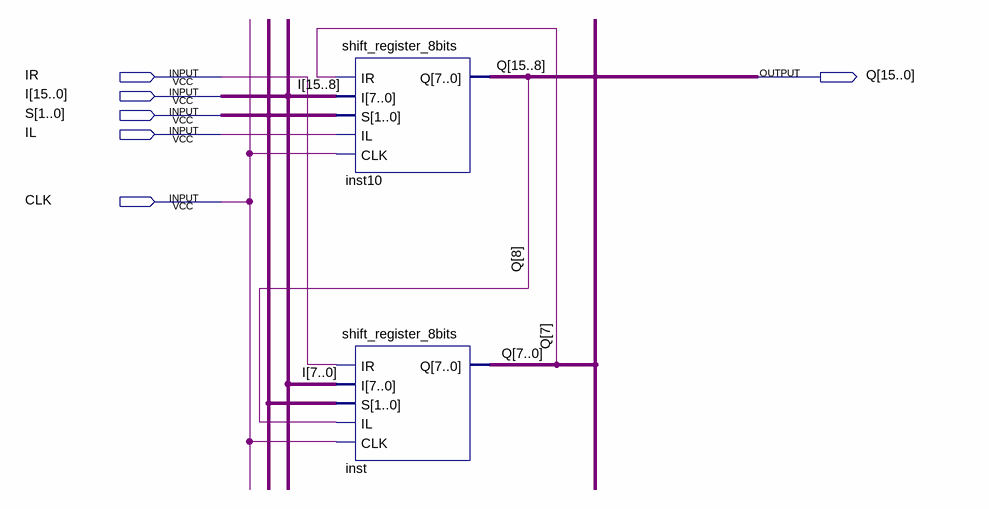
[diagram p0: schematic sheet]
// Quartus schematic shift_register_16bits.bdf as structural Verilog: 2 symbols, 6 pins
module shift_register_16bits (
  input  IR,
  input  [15:0] I,
  input  [1:0] S,
  input  IL,
  input  CLK,
  output [15:0] Q
);

  shift_register_8bits inst10 (.IR(Q[7]), .I(I[15:8]), .S(S), .IL(IL), .CLK(CLK), .Q(Q[15:8]));
  shift_register_8bits inst (.IR(IR), .I(I[7:0]), .S(S), .IL(Q[8]), .CLK(CLK), .Q(Q[7:0]));
endmodule
